# Altium schematic sheet Kanaloa_v2.0.0_Motor.SchDoc
size A
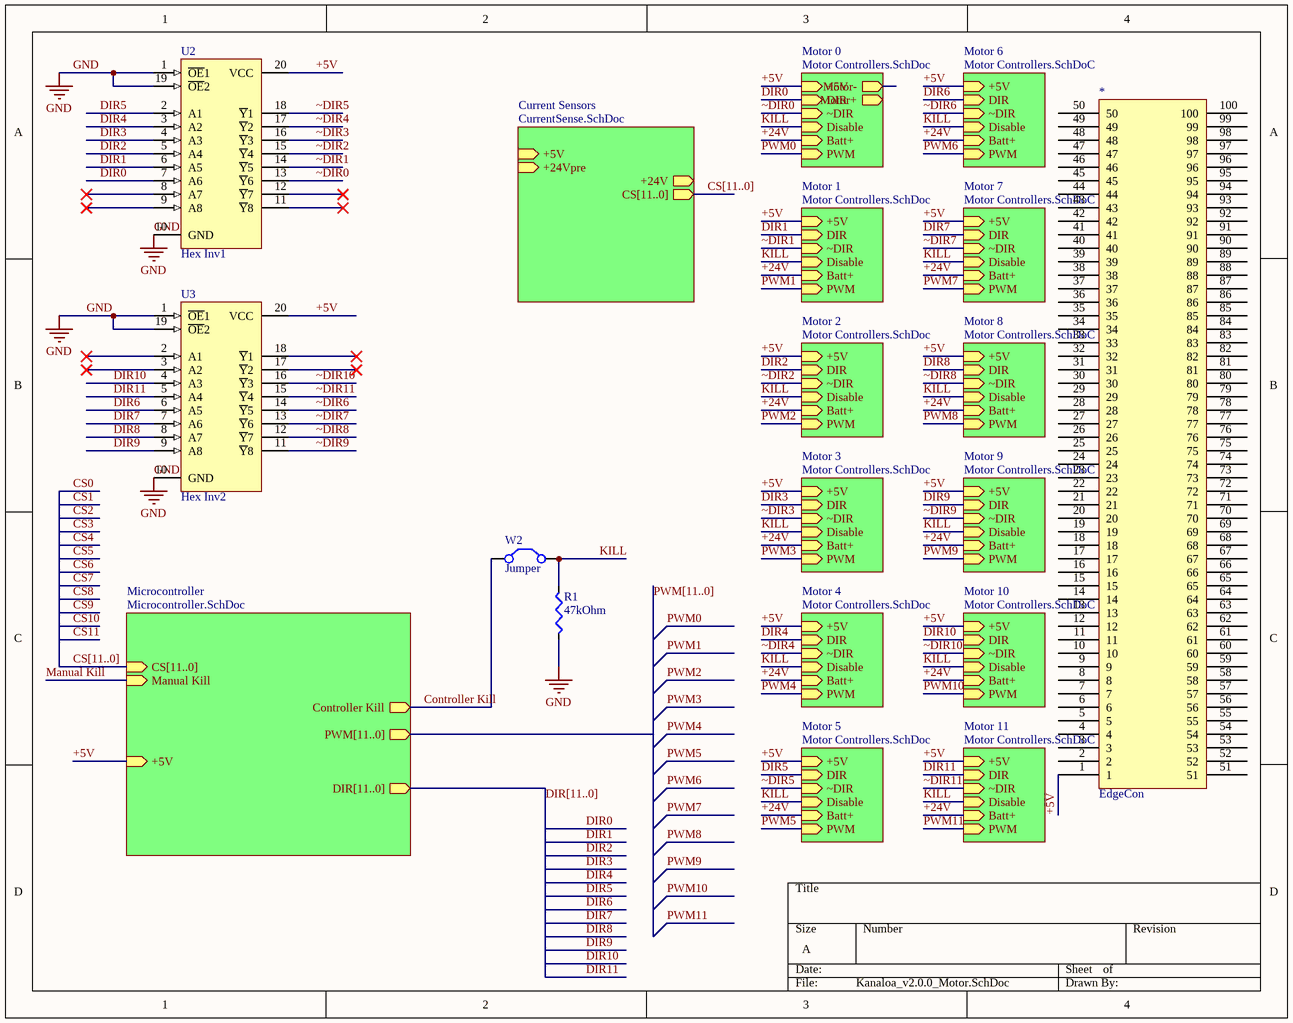
[diagram p0: Kanaloa_v2.0.0_Motor.SchDoc]

## Parts
*  EdgeCon  [5645235-3 CON]
R1  47kOhm  [R 1210 (3225) RESISTOR]
U2  Hex Inv1  [DW020_N]
U3  Hex Inv2  [DW020_N]
W2  Jumper  [RAD-0.2]

## Sub-sheets
Current Sensors = CurrentSense.SchDoc: +5V (in), +24Vpre (in), +24V (out), CS[11..0] (out)
Microcontroller = Microcontroller.SchDoc: PWM[11..0] (out), DIR[11..0] (out), +5V (in), Controller Kill (out), Manual Kill (in), CS[11..0] (in)
Motor 0 = Motor Controllers.SchDoc: +5V (in), DIR (in), ~DIR (in), Disable (in), Batt+ (in), PWM (in), Motor- (out), Motor+ (out)
Motor 1 = Motor Controllers.SchDoc: +5V (in), DIR (in), ~DIR (in), Disable (in), Batt+ (in), PWM (in)
Motor 2 = Motor Controllers.SchDoc: +5V (in), DIR (in), ~DIR (in), Disable (in), Batt+ (in), PWM (in)
Motor 3 = Motor Controllers.SchDoc: +5V (in), DIR (in), ~DIR (in), Disable (in), Batt+ (in), PWM (in)
Motor 4 = Motor Controllers.SchDoc: +5V (in), DIR (in), ~DIR (in), Disable (in), Batt+ (in), PWM (in)
Motor 5 = Motor Controllers.SchDoc: +5V (in), DIR (in), ~DIR (in), Disable (in), Batt+ (in), PWM (in)
Motor 6 = Motor Controllers.SchDoC: +5V (in), DIR (in), ~DIR (in), Disable (in), Batt+ (in), PWM (in)
Motor 7 = Motor Controllers.SchDoC: +5V (in), DIR (in), ~DIR (in), Disable (in), Batt+ (in), PWM (in)
Motor 8 = Motor Controllers.SchDoC: +5V (in), DIR (in), ~DIR (in), Disable (in), Batt+ (in), PWM (in)
Motor 9 = Motor Controllers.SchDoC: +5V (in), DIR (in), ~DIR (in), Disable (in), Batt+ (in), PWM (in)
Motor 10 = Motor Controllers.SchDoC: +5V (in), DIR (in), ~DIR (in), Disable (in), Batt+ (in), PWM (in)
Motor 11 = Motor Controllers.SchDoC: +5V (in), DIR (in), ~DIR (in), Disable (in), Batt+ (in), PWM (in)

## Nets
GND: R1.1 U2.1(~{OE}1) U2.10(GND) U2.19(~{OE}2) U3.1(~{OE}1) U3.10(GND) U3.19(~{OE}2)
+5V: *.1 U2.20(VCC) U3.20(VCC) ; sheet Microcontroller/+5V, sheet Motor 0/+5V, sheet Motor 6/+5V, sheet Motor 1/+5V, sheet Motor 7/+5V, sheet Motor 2/+5V, sheet Motor 8/+5V, sheet Motor 3/+5V, sheet Motor 9/+5V, sheet Motor 4/+5V, sheet Motor 10/+5V, sheet Motor 5/+5V, sheet Motor 11/+5V
+24V: sheet Motor 0/Batt+, sheet Motor 6/Batt+, sheet Motor 1/Batt+, sheet Motor 7/Batt+, sheet Motor 2/Batt+, sheet Motor 8/Batt+, sheet Motor 3/Batt+, sheet Motor 9/Batt+, sheet Motor 4/Batt+, sheet Motor 10/Batt+, sheet Motor 5/Batt+, sheet Motor 11/Batt+
Controller Kill: W2.1(C1) ; sheet Microcontroller/Controller Kill
DIR0: U2.7(A6) ; sheet Motor 0/DIR
DIR1: U2.6(A5) ; sheet Motor 1/DIR
DIR2: U2.5(A4) ; sheet Motor 2/DIR
DIR3: U2.4(A3) ; sheet Motor 3/DIR
DIR4: U2.3(A2) ; sheet Motor 4/DIR
DIR5: U2.2(A1) ; sheet Motor 5/DIR
DIR6: U3.6(A5) ; sheet Motor 6/DIR
DIR7: U3.7(A6) ; sheet Motor 7/DIR
DIR8: U3.8(A7) ; sheet Motor 8/DIR
DIR9: U3.9(A8) ; sheet Motor 9/DIR
DIR10: U3.4(A3) ; sheet Motor 10/DIR
DIR11: U3.5(A4) ; sheet Motor 11/DIR
KILL: R1.2 W2.2(C2) ; sheet Motor 0/Disable, sheet Motor 6/Disable, sheet Motor 1/Disable, sheet Motor 7/Disable, sheet Motor 2/Disable, sheet Motor 8/Disable, sheet Motor 3/Disable, sheet Motor 9/Disable, sheet Motor 4/Disable, sheet Motor 10/Disable, sheet Motor 5/Disable, sheet Motor 11/Disable
Manual Kill: sheet Microcontroller/Manual Kill
PWM0: sheet Motor 0/PWM
PWM1: sheet Motor 1/PWM
PWM2: sheet Motor 2/PWM
PWM3: sheet Motor 3/PWM
PWM4: sheet Motor 4/PWM
PWM5: sheet Motor 5/PWM
PWM6: sheet Motor 6/PWM
PWM7: sheet Motor 7/PWM
PWM8: sheet Motor 8/PWM
PWM9: sheet Motor 9/PWM
PWM10: sheet Motor 10/PWM
PWM11: sheet Motor 11/PWM
~DIR0: U2.13(~{Y}6) ; sheet Motor 0/~DIR
~DIR1: U2.14(~{Y}5) ; sheet Motor 1/~DIR
~DIR2: U2.15(~{Y}4) ; sheet Motor 2/~DIR
~DIR3: U2.16(~{Y}3) ; sheet Motor 3/~DIR
~DIR4: U2.17(~{Y}2) ; sheet Motor 4/~DIR
~DIR5: U2.18(~{Y}1) ; sheet Motor 5/~DIR
~DIR6: U3.14(~{Y}5) ; sheet Motor 6/~DIR
~DIR7: U3.13(~{Y}6) ; sheet Motor 7/~DIR
~DIR8: U3.12(~{Y}7) ; sheet Motor 8/~DIR
~DIR9: U3.11(~{Y}8) ; sheet Motor 9/~DIR
~DIR10: U3.16(~{Y}3) ; sheet Motor 10/~DIR
~DIR11: U3.15(~{Y}4) ; sheet Motor 11/~DIR

Not connected (* = marked no-connect by the designer): * 2 3 4 5 6 7 8 9 10 11 12 13 14 15 16 17 18 19 20 21 22 23 24 25 26 27 28 29 30 31 32 33 34 35 36 37 38 39 40 41 42 43 44 45 46 47 48 49 50 51 52 53 54 55 56 57 58 59 60 61 62 63 64 65 66 67 68 69 70 71 72 73 74 75 76 77 78 79 80 81 82 83 84 85 86 87 88 89 90 91 92 93 94 95 96 97 98 99 100; U2 8(A7)* 9(A8)* 11(~{Y}8)* 12(~{Y}7)*; U3 2(A1)* 3(A2)* 17(~{Y}2)* 18(~{Y}1)*

## Buses and harness runs
bus CS[11..0] = sheet Current Sensors/CS[11..0]
bus CS[11..0] = sheet Microcontroller/CS[11..0]
bus DIR[11..0] = sheet Microcontroller/DIR[11..0]
bus PWM[11..0] = sheet Microcontroller/PWM[11..0]

## Library data of the parts
R1 = Resistor: Value: 0Ohm
U2 U3 = SN74HCT540DW: Octal Buffer and Line Driver with 3-State Outputs; Published: 8-Jun-2000; LatestRevisionDate: 13-Apr-2006; LatestRevisionNote: IPC-7351 Footprint Added.; DatasheetVersion: May-1997; PackageVersion: Mar-2000; PackageReference: DW020; Publisher: Altium Limited; PackageDescription: 20-Pin Plastic Small Outline Integrated Circuit 1.27 mm Pitch; Code_JEDEC: MS-013; Code_IPC: SOIC127P1030-20; ComponentLink1Description: Manufacturer Link; ComponentLink1URL: http://www.ti.com/; ComponentLink2Description: Datasheet; ComponentLink2URL: http://www-s.ti.com/sc/ds/sn74hct540.pdf
W2 = Jumper: Jumper Wire; Published: 24-Mar-1999; LatestRevisionDate: 17-Jul-2002; LatestRevisionNote: Re-released for DXP Platform.; PackageReference: RAD-0.2; Publisher: Altium Limited